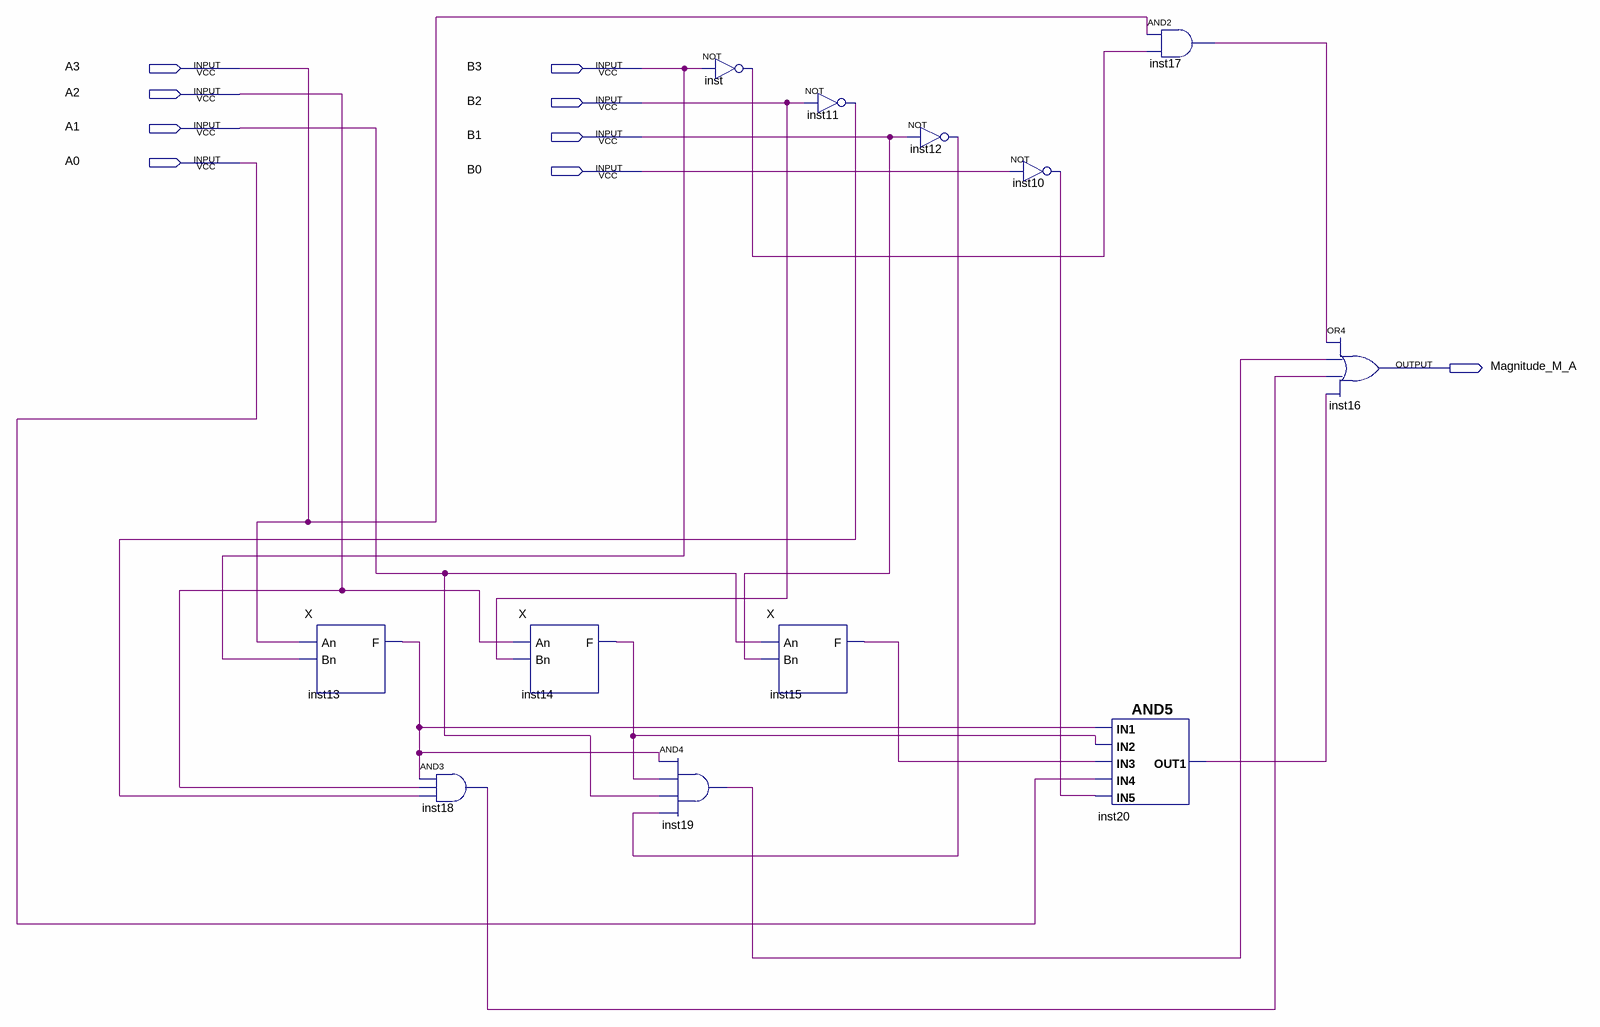
[diagram p0: schematic sheet]
// Quartus schematic CompMagnitude_M_A.bdf as structural Verilog: 12 symbols, 9 pins
module CompMagnitude_M_A (
  input  A3,
  input  B3,
  input  A2,
  input  B2,
  input  A1,
  input  B1,
  input  A0,
  input  B0,
  output Magnitude_M_A
);

  wire inst10_out, inst11_out, inst12_out, inst13_f, inst14_f, inst15_f, inst17_out, inst18_out, inst19_out,
       inst20_out1, inst_out;

  X inst13 (.An(A3), .Bn(B3), .F(inst13_f));
  and inst18 (inst18_out, inst13_f, A2, inst11_out);
  X inst14 (.An(A2), .Bn(B2), .F(inst14_f));
  not inst (inst_out, B3);
  and inst19 (inst19_out, inst13_f, inst14_f, A1, inst12_out);
  X inst15 (.An(A1), .Bn(B1), .F(inst15_f));
  not inst11 (inst11_out, B2);
  not inst12 (inst12_out, B1);
  not inst10 (inst10_out, B0);
  AND5 inst20 (.IN3(inst15_f), .IN2(inst14_f), .IN1(inst13_f), .IN5(inst10_out), .IN4(A0), .OUT1(inst20_out1));
  and inst17 (inst17_out, A3, inst_out);
  or inst16 (Magnitude_M_A, inst17_out, inst19_out, inst18_out, inst20_out1);
endmodule
